# Altium schematic sheet Slave4_flying_pcb_v1.SchDoc
size A4
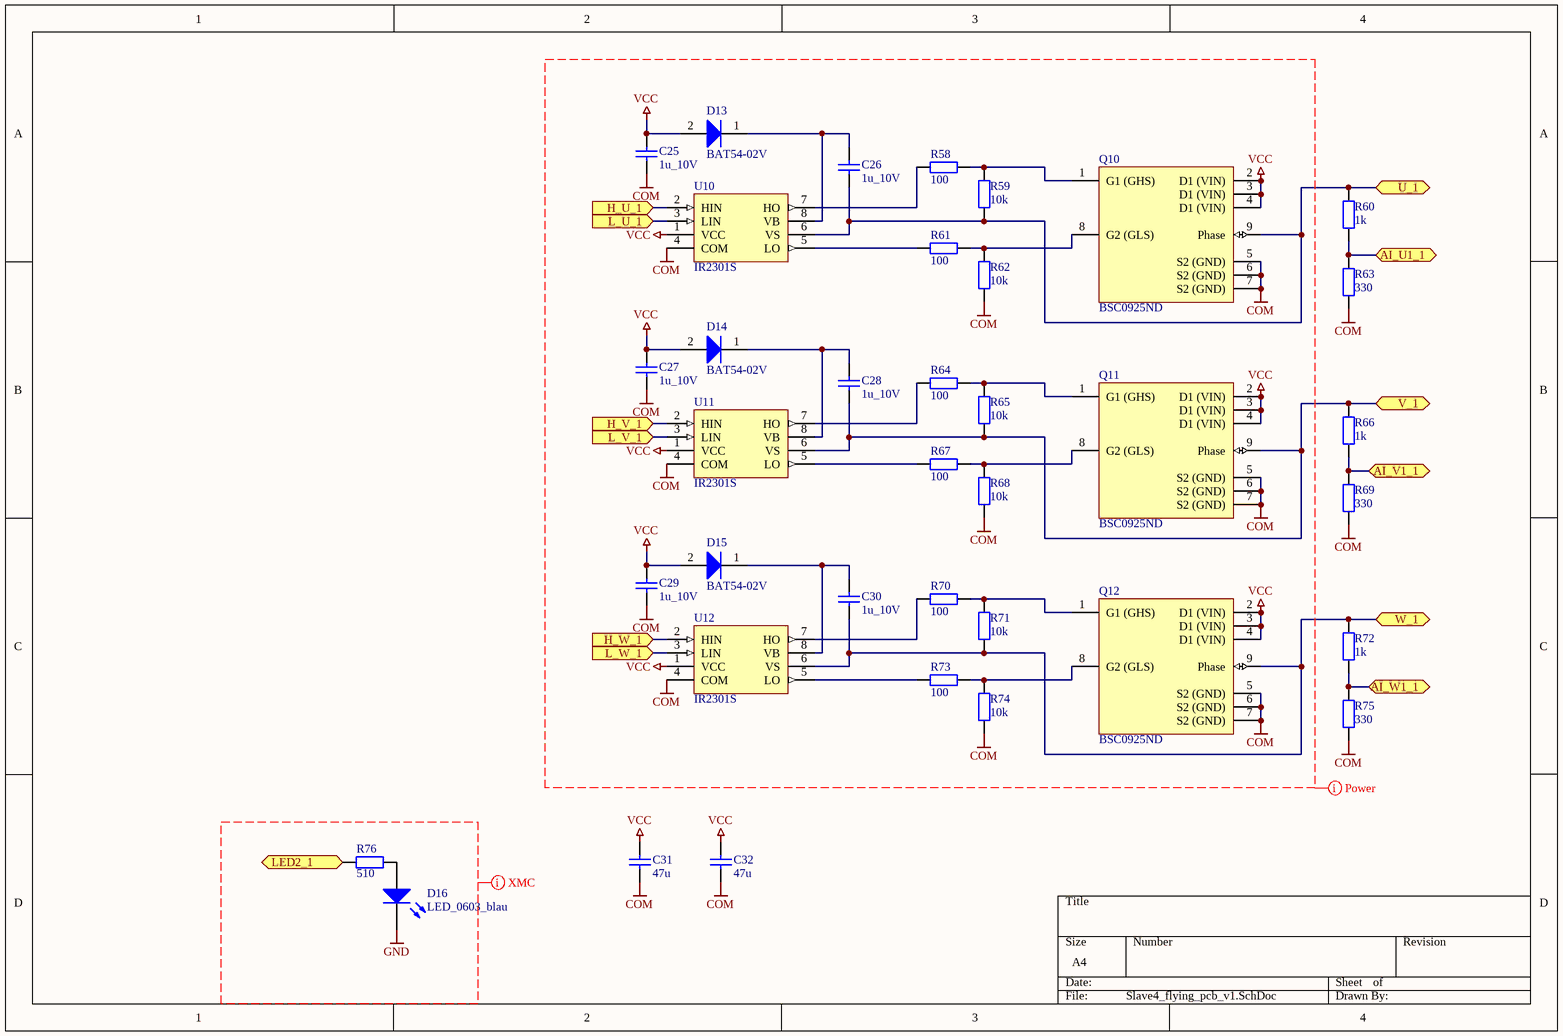
[diagram p0: Slave4_flying_pcb_v1.SchDoc]

## Parts
C25  1u_10V  [1608[0603]]
C26  1u_10V  [1608[0603]]
C27  1u_10V  [1608[0603]]
C28  1u_10V  [1608[0603]]
C29  1u_10V  [1608[0603]]
C30  1u_10V  [1608[0603]]
C31  47u  [_0805]
C32  47u  [_0805]
D13  BAT54-02V  [INF-SC79_V]
D14  BAT54-02V  [INF-SC79_V]
D15  BAT54-02V  [INF-SC79_V]
D16  LED_0603_blau  [LED_0603]
Q10  BSC0925ND  [INF-PG-TISON-8_V]
Q11  BSC0925ND  [INF-PG-TISON-8_V]
Q12  BSC0925ND  [INF-PG-TISON-8_V]
R58  value 100  [1608[0603]]  (hidden comment: Res_0603)
R59  value 10k  [1608[0603]]  (hidden comment: Res_0603)
R60  value 1k  [1608[0603]]  (hidden comment: Res_0603)
R61  value 100  [1608[0603]]  (hidden comment: Res_0603)
R62  value 10k  [1608[0603]]  (hidden comment: Res_0603)
R63  value 330  [1608[0603]]  (hidden comment: Res_0603)
R64  value 100  [1608[0603]]  (hidden comment: Res_0603)
R65  value 10k  [1608[0603]]  (hidden comment: Res_0603)
R66  value 1k  [1608[0603]]  (hidden comment: Res_0603)
R67  value 100  [1608[0603]]  (hidden comment: Res_0603)
R68  value 10k  [1608[0603]]  (hidden comment: Res_0603)
R69  value 330  [1608[0603]]  (hidden comment: Res_0603)
R70  value 100  [1608[0603]]  (hidden comment: Res_0603)
R71  value 10k  [1608[0603]]  (hidden comment: Res_0603)
R72  value 1k  [1608[0603]]  (hidden comment: Res_0603)
R73  value 100  [1608[0603]]  (hidden comment: Res_0603)
R74  value 10k  [1608[0603]]  (hidden comment: Res_0603)
R75  value 330  [1608[0603]]  (hidden comment: Res_0603)
R76  value 510  [1608[0603]]  (hidden comment: Res_0603)
U10  IR2301S  [SO-8_N]
U11  IR2301S  [SO-8_N]
U12  IR2301S  [SO-8_N]

## Ports
AI_U1_1 (bidir), AI_V1_1 (bidir), AI_W1_1 (bidir), H_U_1, H_V_1, H_W_1, L_U_1, L_V_1, L_W_1, LED2_1, U_1 (bidir), V_1 (bidir), W_1 (bidir)

## Nets
COM: C25.2 C27.2 C29.2 C31.1 C32.1 Q10.5(S2_(GND)) Q10.6(S2_(GND)) Q10.7(S2_(GND)) Q11.5(S2_(GND)) Q11.6(S2_(GND)) Q11.7(S2_(GND)) Q12.5(S2_(GND)) Q12.6(S2_(GND)) Q12.7(S2_(GND)) R62.2 R63.2 R68.2 R69.2 R74.2 R75.2 U10.4(COM) U11.4(COM) U12.4(COM)
GND: D16.2
VCC: C25.1 C27.1 C29.1 C31.2 C32.2 D13.2(A) D14.2(A) D15.2(A) Q10.2(D1_(VIN)) Q10.3(D1_(VIN)) Q10.4(D1_(VIN)) Q11.2(D1_(VIN)) Q11.3(D1_(VIN)) Q11.4(D1_(VIN)) Q12.2(D1_(VIN)) Q12.3(D1_(VIN)) Q12.4(D1_(VIN)) U10.1(VCC) U11.1(VCC) U12.1(VCC)
AI_U1_1: R60.2 R63.1 ; port AI_U1_1
AI_V1_1: R66.2 R69.1 ; port AI_V1_1
AI_W1_1: R72.2 R75.1 ; port AI_W1_1
H_U_1: U10.2(HIN) ; port H_U_1
H_V_1: U11.2(HIN) ; port H_V_1
H_W_1: U12.2(HIN) ; port H_W_1
L_U_1: U10.3(LIN) ; port L_U_1
L_V_1: U11.3(LIN) ; port L_V_1
L_W_1: U12.3(LIN) ; port L_W_1
LED2_1: R76.1 ; port LED2_1
U_1: C26.2 Q10.9(Phase) R59.2 R60.1 U10.6(VS) ; port U_1
V_1: C28.2 Q11.9(Phase) R65.2 R66.1 U11.6(VS) ; port V_1
W_1: C30.2 Q12.9(Phase) R71.2 R72.1 U12.6(VS) ; port W_1
NetC26_1: C26.1 D13.1(K) U10.8(VB)
NetC28_1: C28.1 D14.1(K) U11.8(VB)
NetC30_1: C30.1 D15.1(K) U12.8(VB)
NetD16_1: D16.1 R76.2
NetQ10_1: Q10.1(G1_(GHS)) R58.1 R59.1
NetQ10_8: Q10.8(G2_(GLS)) R61.1 R62.1
NetQ11_1: Q11.1(G1_(GHS)) R64.1 R65.1
NetQ11_8: Q11.8(G2_(GLS)) R67.1 R68.1
NetQ12_1: Q12.1(G1_(GHS)) R70.1 R71.1
NetQ12_8: Q12.8(G2_(GLS)) R73.1 R74.1
NetR58_2: R58.2 U10.7(HO)
NetR61_2: R61.2 U10.5(LO)
NetR64_2: R64.2 U11.7(HO)
NetR67_2: R67.2 U11.5(LO)
NetR70_2: R70.2 U12.7(HO)
NetR73_2: R73.2 U12.5(LO)

## Layout directives
net class Power: COM, VCC
net class XMC: GND

## Library data of the parts
C25-C30 = Cap_133: RS_number: 788-2884; QR: 0; Capacity: 1u; Voltage: 10V; UID: Cap_133; Name: 1u_10V; Name_Hyperlink: http://at.rs-online.com/web/p/keramik-multilayer-kondensatoren/7882884; ComponentLink1URL: #NAME?; mounting: SMD
C31 C32 = Cap_133: Name: Cap_cer_1u_50V; Capacity: 1u; Voltage: 50V; RS_number: 723-6350; QR: 0; UID: Cap_133; ComponentLink1URL: #NAME?; mounting: SMD; Name_Hyperlink: http://at.rs-online.com/web/p/keramik-multilayer-kondensatoren/7236350/
D13-D15 = BAT54-02V: Silicon Schottky Diode, SC79, Reel, Green; Manufacturer: Infineon; Green: TRUE; PackageReference: SC79; PackageDescription: 2-Pin Semiconductor Package, 0.8 x 1.2 mm Body; Supplier 1: Mouser; Supplier Part Number 1: N/A; Halogen-free: FALSE; Mounting Technology: Surface Mount; PartNumber: BAT54-02V; ComponentLink1Description: Manufacturer URL; ComponentLink1URL: http://www.infineon.com/; ComponentLink2Description: Datasheet; ComponentLink2URL: http://www.infineon.com/dgdl/bat54series.pdf?folderId=db3a30431400ef68011425f1ca2505e3&fileId=db3a304314dca3890115190b74210ea6; ComponentLink3Description: Package Specification; ComponentLink3URL: http://www.infineon.com/dgdl/SC79-Package_Overview.pdf?folderId=db3a30431936bc4b011951fbddb03b15&fileId=db3a30431936bc4b01195226fe583b41
D16 = DIODE_60: Type: LED; Colour: blau; RS_number: 697-3610P; QR: 0; UID: DIODE_60; Name: LED_0603_blau; Name_Hyperlink: http://at.rs-online.com/web/p/products/6973610P/; ComponentLink1URL: #WERT!; mounting: SMD
Q10-Q12 = BSC0925ND: N-Channel OptiMOS Power-MOSFET, 30 V VDS, 40 A ID, -55 to 150 degC, PG-TISON-8, Reel, Green; Manufacturer: Infineon; Green: TRUE; ID (max): 40 A; IDpuls (max): 160 A; Polarity: N; Ptot (max): 30 W; QG: 6.7 nC; RDS (on) (max): 5 mOhm; RDS (on) (max) (@4.5V): 7 mOhm; Rth: 4.2 K/W; RthJA (max): 125 K/W; VDS (max): 30 V; VGS(th) (max): 2 V; VGS(th) (min): 1.2 V; DatasheetVersion: Rev. 1.0; PackageVersion: Rev. 01, 09/2011; PackageReference: PG-TISON-8; PackageDescription: 8-Pin Plastic (Green) Small Outline Non-Leaded Package, 5 x 6 mm Body, 1.27 mm Pitch; Halogen-free: TRUE; Packing: Reel; RthJC (max): 4.2 K/W; Mounting Technology: Surface Mount; PartNumber: BSC0925ND; ComponentLink1Description: Manufacturer URL; ComponentLink1URL: http://www.infineon.com/; ComponentLink2Description: Datasheet; ComponentLink2URL: http://www.infineon.com/dgdl/BSC0925ND_rev1+0.pdf?folderId=db3a304313b8b5a60113cee8763b02d7&fileId=db3a304336ca04c90136cec562a24914; ComponentLink3Description: Package Specification; ComponentLink3URL: http://www.infineon.com/dgdl/BSC0910NDI_Rev. 0.5.pdf?folderId=db3a304313b8b5a60113cee8763b02d7&fileId=db3a304336ca04c90136cedc08b64926
R58-R76 = Res_6: UID: Res_6; Name: Res_0603; ComponentLink1URL: #NAME?; mounting: SMD
U10-U12 = IR2101S: High and Low Side Driver; Published: 8-Jun-2000; LatestRevisionDate: 13-Apr-2006; LatestRevisionNote: IPC-7351 Footprint Added.; DatasheetVersion: PD60043J; PackageVersion: Feb-2001; PackageReference: SO-8; Publisher: Altium Limited; PackageDescription: 8-Pin Plastic Small Outline Integrated Circuit 1.27 mm Pitch; Code_JEDEC: MS-012-AA; Code_IPC: SOIC127P600-8; ComponentLink1Description: Manufacturer Link; ComponentLink1URL: http://www.irf.com/